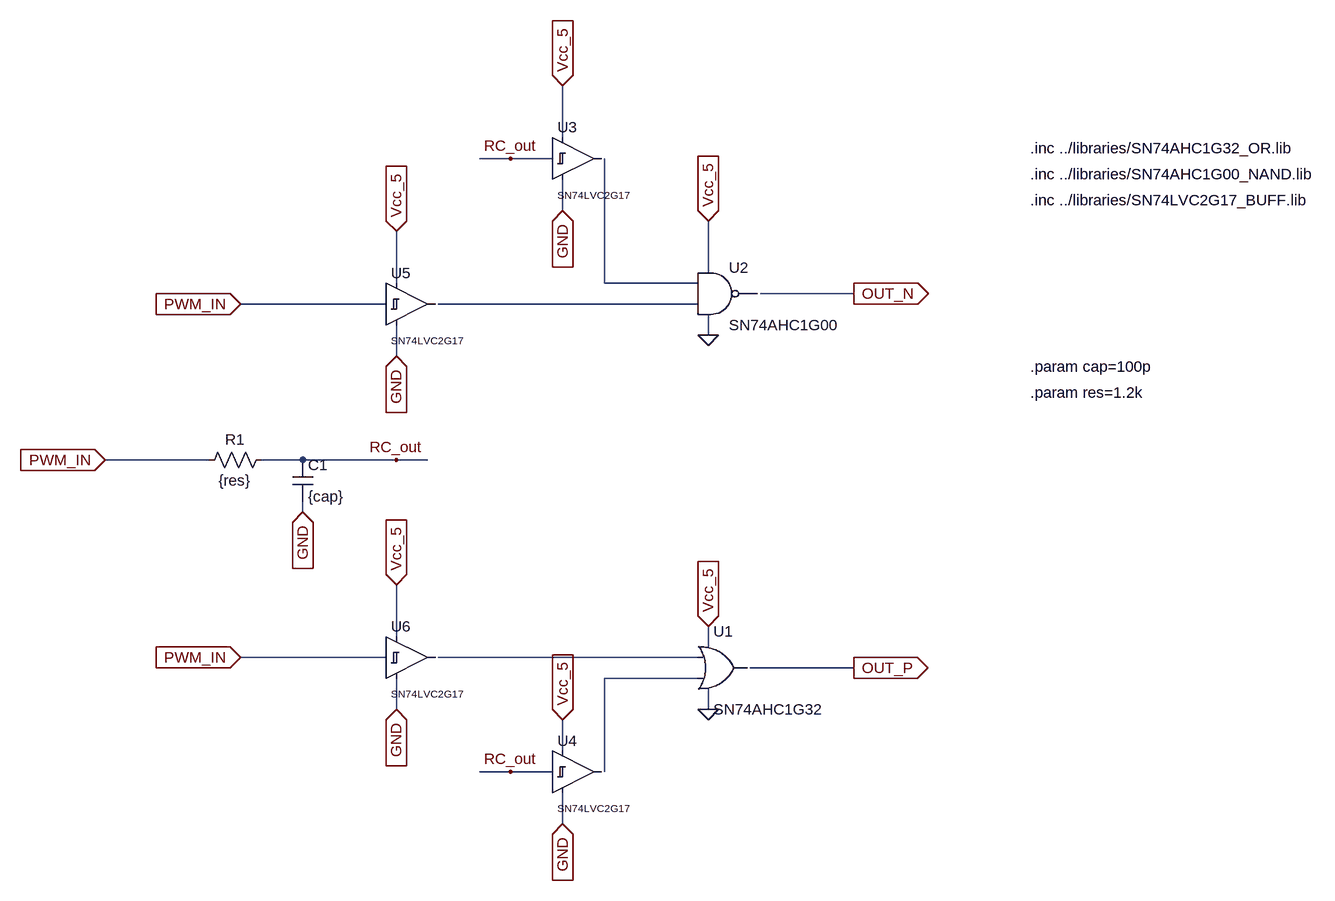
[diagram p0: schematic Deadtime_component.asc]
Deadtime_component.asc, the LTspice schematic file:
Version 4
SHEET 1 1604 848
WIRE -96 -320 -96 -400
WIRE -176 -288 -224 -288
WIRE -112 -288 -176 -288
WIRE -96 -208 -96 -256
WIRE 128 -112 128 -192
WIRE -352 -96 -352 -176
WIRE -32 -96 -32 -288
WIRE 112 -96 -32 -96
WIRE 352 -80 208 -80
WIRE -368 -64 -592 -64
WIRE 112 -64 -288 -64
WIRE 128 -16 128 -48
WIRE -352 16 -352 -32
WIRE -640 176 -800 176
WIRE -496 176 -560 176
WIRE -352 176 -496 176
WIRE -304 176 -352 176
WIRE -496 256 -496 240
WIRE -352 448 -352 368
WIRE 128 464 128 432
WIRE -368 480 -592 480
WIRE 112 480 -288 480
WIRE 352 496 192 496
WIRE 112 512 -32 512
WIRE -352 560 -352 512
WIRE 128 560 128 528
WIRE -96 624 -96 576
WIRE -176 656 -224 656
WIRE -112 656 -176 656
WIRE -32 656 -32 512
WIRE -96 736 -96 688
FLAG 128 -16 0
FLAG 128 560 0
FLAG 128 -192 Vcc_5
IOPIN 128 -192 In
FLAG 128 432 Vcc_5
IOPIN 128 432 In
FLAG -96 576 Vcc_5
IOPIN -96 576 In
FLAG -96 -400 Vcc_5
IOPIN -96 -400 In
FLAG 352 496 OUT_P
IOPIN 352 496 Out
FLAG 352 -80 OUT_N
IOPIN 352 -80 Out
FLAG -592 -64 PWM_IN
IOPIN -592 -64 In
FLAG -592 480 PWM_IN
IOPIN -592 480 In
FLAG -496 256 GND
IOPIN -496 256 In
FLAG -96 -208 GND
IOPIN -96 -208 In
FLAG -96 736 GND
IOPIN -96 736 In
FLAG -800 176 PWM_IN
IOPIN -800 176 In
FLAG -352 176 RC_out
FLAG -176 -288 RC_out
FLAG -176 656 RC_out
FLAG -352 -176 Vcc_5
IOPIN -352 -176 In
FLAG -352 16 GND
IOPIN -352 16 In
FLAG -352 368 Vcc_5
IOPIN -352 368 In
FLAG -352 560 GND
IOPIN -352 560 In
SYMBOL schmitt_buffer -112 -352 R0
WINDOW 3 8 120 Left 1
SYMATTR InstName U3
SYMBOL schmitt_buffer -112 592 R0
WINDOW 3 8 120 Left 1
SYMATTR InstName U4
SYMBOL res -544 160 R90
WINDOW 0 0 56 VBottom 2
WINDOW 3 32 56 VTop 2
SYMATTR InstName R1
SYMATTR Value {res}
SYMBOL cap -512 176 R0
SYMATTR InstName C1
SYMATTR Value {cap}
SYMBOL my_or 144 432 R0
SYMATTR InstName U1
SYMBOL my_nand 144 -144 R0
SYMATTR InstName U2
SYMBOL schmitt_buffer -368 -128 R0
WINDOW 3 8 120 Left 1
SYMATTR InstName U5
SYMBOL schmitt_buffer -368 416 R0
WINDOW 3 8 120 Left 1
SYMATTR InstName U6
TEXT 624 -304 Left 2 !.inc ../libraries/SN74AHC1G32_OR.lib
TEXT 624 -264 Left 2 !.inc ../libraries/SN74AHC1G00_NAND.lib
TEXT 624 -224 Left 2 !.inc ../libraries/SN74LVC2G17_BUFF.lib
TEXT 624 32 Left 2 !.param cap=100p
TEXT 624 72 Left 2 !.param res=1.2k

The netlist it stands for:
* Deadtime_component.asc
XU3 N001 RC_out Vcc_5 GND SN74LVC2G17  ; pins Y A VCC AGND
XU4 N004 RC_out Vcc_5 GND SN74LVC2G17  ; pins Y A VCC AGND
R1 RC_out PWM_IN {res}
C1 RC_out GND {cap}
XU1 OUT_P N003 N004 Vcc_5 0 SN74AHC1G32  ; pins Y A B VCC AGND
XU2 OUT_N N001 N002 Vcc_5 0 SN74AHC1G00  ; pins Y A B VCC AGND
XU5 N002 PWM_IN Vcc_5 GND SN74LVC2G17  ; pins Y A VCC AGND
XU6 N003 PWM_IN Vcc_5 GND SN74LVC2G17  ; pins Y A VCC AGND
.inc ../libraries/SN74AHC1G32_OR.lib
.inc ../libraries/SN74AHC1G00_NAND.lib
.inc ../libraries/SN74LVC2G17_BUFF.lib
.param cap=100p
.param res=1.2k
.backanno
.end